# Altium schematic sheet Display.SchDoc
size A; SheetNumber: 4; SheetTotal: 8
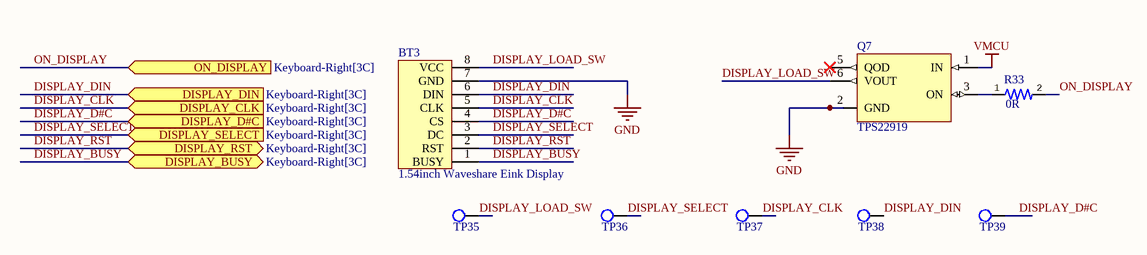
[diagram p0: Display.SchDoc]

## Parts
BT3  1.54inch Waveshare Eink Display  [1.54inch waveshare eink]
Q7  TPS22919  [TPS22919DCKR - Load SW]
R33  value 0R  [Resistor 0402]  (hidden comment: RES 0R 0402)
TP35  Test point  [Test Point]  (value not drawn)  (no BOM)
TP36  Test point  [Test Point]  (value not drawn)  (no BOM)
TP37  Test point  [Test Point]  (value not drawn)  (no BOM)
TP38  Test point  [Test Point]  (value not drawn)  (no BOM)
TP39  Test point  [Test Point]  (value not drawn)  (no BOM)

## Ports
DISPLAY_BUSY (bidir, see Keyboard-Right[3C]), DISPLAY_CLK (in, see Keyboard-Right[3C]), DISPLAY_D#C (in, see Keyboard-Right[3C]), DISPLAY_DIN (in, see Keyboard-Right[3C]), DISPLAY_RST (bidir, see Keyboard-Right[3C]), DISPLAY_SELECT (in, see Keyboard-Right[3C]), ON_DISPLAY (in, see Keyboard-Right[3C])

## Nets
GND: BT3.7(GND) Q7.2(GND)
VMCU: Q7.1(IN)
DISPLAY_BUSY: BT3.1(BUSY) ; port DISPLAY_BUSY
DISPLAY_CLK: BT3.5(CLK) TP37.1 ; port DISPLAY_CLK
DISPLAY_D#C: BT3.4(CS) TP39.1 ; port DISPLAY_D#C
DISPLAY_DIN: BT3.6(DIN) TP38.1 ; port DISPLAY_DIN
DISPLAY_LOAD_SW: BT3.8(VCC) Q7.6(VOUT) TP35.1
DISPLAY_RST: BT3.2(RST) ; port DISPLAY_RST
DISPLAY_SELECT: BT3.3(DC) TP36.1 ; port DISPLAY_SELECT
ON_DISPLAY: R33.2 ; port ON_DISPLAY
NetQ7_3: Q7.3(ON) R33.1

Not connected (* = marked no-connect by the designer): Q7 5(QOD)*

## Library data of the parts
BT3 = 1.54inch Waveshare Eink Display: No backlight, keeps displaying last content for a long time even when power down / Ultra low power consumption, basically power is only required for refreshing / SPI interface, for connecting with controller boards like Raspberry Pi/Arduino/Nucleo, etc. / Onboard voltage translator, compatible with 3.3V/5V MCUs / Comes with development resources and manual (examples for Raspberry Pi/Jetson Nano/Arduino/STM32) / Specifications / Operating voltage: 3.3V/5V / Interface: 3-wire SPI, 4-wire SPI / Outline dimension: 48mm × 33mm / Display size: 27.6mm × 27.6mm / Dot pitch: 0.138 × 0.138 / Resolution: 200 × 200 / Display color: black, white / Grey level: 2 / Partial refresh time: 0.3s / Full refresh time: 2s / Refresh power: 26.4mW(typ.) / Standby power: <0.017mW / Viewing angle: >170°
Q7 = TPS22919: Buffer/Inverter Based Peripheral Driver, 3A, PDSO6; Manufacturer: Texas Instruments; Manufacturer Part Number: TPS22919DCKT; Supplier: Mouser; Supplier Part Number: 595-TPS22919DCKT; RoHS: Yes; Category: Power Management ICs; Stock: 6490; Pricing: 1=0.94, 10=0.712, 50=0.712, 100=0.413, 1000=0.308, 10000=0.308 (USD); ComponentLink1URL: https://www.ti.com:443/lit/ds/symlink/tps22919.pdf?src-supplier=IHS+Markit; ComponentLink1Description: https://www.ti.com:443/lit/ds/symlink/tps22919.pdf?src-supplier=IHS+Markit; ComponentLink2URL: http://www.ti.com/general/docs/suppproductinfo.tsp?distId=10&amp;gotoUrl=http%3A%2F%2Fwww.ti.com%2Flit%2Fgpn%2Ftps22919&src-supplier=Digikey; ComponentLink2Description: http://www.ti.com/general/docs/suppproductinfo.tsp?distId=10&amp;gotoUrl=http%3A%2F%2Fwww.ti.com%2Flit%2Fgpn%2Ftps22919&src-supplier=Digikey
R33 = RES 0R 0402: Metal Glaze/thick Film, 0.0625W, 0ohm, Surface Mount, 0402; Manufacturer: Yageo; Manufacturer Part Number: RC0402JR-070RL; Power: 62.5mW; Rated Temperature: 70°C; Package Height: 0.35mm; Package Length: 1mm; Package Width: 0.5mm; Supplier: Digikey; Supplier Part Number: 311-0.0JRCT-ND; RoHS: Yes; Category: Chip SMD Resistors; Stock: 15179907; Pricing: 1=0.1, 10=0.011, 25=0.0084, 50=0.0064, 100=0.0045, 250=0.00364, 500=0.0029, 1000=0.00214, 5000=0.00154, 10000=0.00133, 30000=0.00117, 50000=0.00107, 100000=0.00105 (USD); Mounting Technology: Surface Mount; Pins: 2; Package Shape: Rectangular; Case/Package: 0402; Terminal Finish: Nickel; Min Operating Temperature: -55°C; Max Operating Temperature: 155°C; JESD-609 Code: e3; Resistor Type: FIXED RESISTOR; Construction: Chip; Package Style: SMTMeter; Packaging: Tape and Reel; Technology: METAL GLAZE/THICK FILM; Termination: Wraparound; Reach SVHC Compliant: Yes; RoHS Compliant: Yes; ComponentLink1URL: https://datasheet.ciiva.com:443/pdfs/VipMasterIC/IC/YAGO/YAGO-S-A0008145938/YAGO-S-A0008145938-1.pdf?src-supplier=IHS+Markit; ComponentLink1Description: https://datasheet.ciiva.com:443/pdfs/VipMasterIC/IC/YAGO/YAGO-S-A0008145938/YAGO-S-A0008145938-1.pdf?src-supplier=IHS+Markit; ComponentLink2URL: https://datasheet.ciiva.com/2452/pyu-rc0402-51-rohs-l-6-2452608.pdf?src-supplier=Digikey; ComponentLink2Description: https://datasheet.ciiva.com/2452/pyu-rc0402-51-rohs-l-6-2452608.pdf?src-supplier=Digikey; ComponentLink3URL: https://datasheet.ciiva.com/11808/0900766b80c66297-11808195.pdf?src-supplier=Rs; ComponentLink3Description: https://datasheet.ciiva.com/11808/0900766b80c66297-11808195.pdf?src-supplier=Rs; ComponentLink4URL: https://datasheet.ciiva.com/2452/pyu-r-int-thick-7-2452609.pdf?src-supplier=Digikey; ComponentLink4Description: https://datasheet.ciiva.com/2452/pyu-r-int-thick-7-2452609.pdf?src-supplier=Digikey; ComponentLink5URL: https://datasheet.ciiva.com/2452/pyu-r-int-thick-7-2452610.pdf?src-supplier=Digikey; ComponentLink5Description: https://datasheet.ciiva.com/2452/pyu-r-int-thick-7-2452610.pdf?src-supplier=Digikey; ComponentLink6URL: https://datasheet.ciiva.com/8896/pyu-rc0402-51-rohs-l-6-8896201.pdf?src-supplier=Avnet; ComponentLink6Description: https://datasheet.ciiva.com/8896/pyu-rc0402-51-rohs-l-6-8896201.pdf?src-supplier=Avnet; ComponentLink7URL: https://datasheet.ciiva.com/7983/1018594-7983535.pdf?src-supplier=Element14; ComponentLink7Description: https://datasheet.ciiva.com/7983/1018594-7983535.pdf?src-supplier=Element14; ComponentLink8URL: https://datasheet.ciiva.com/22747/1018594-22747515.pdf?src-supplier=Element14; ComponentLink8Description: https://datasheet.ciiva.com/22747/1018594-22747515.pdf?src-supplier=Element14